# Altium project 004_basit_egitim_robotu.PrjPcb
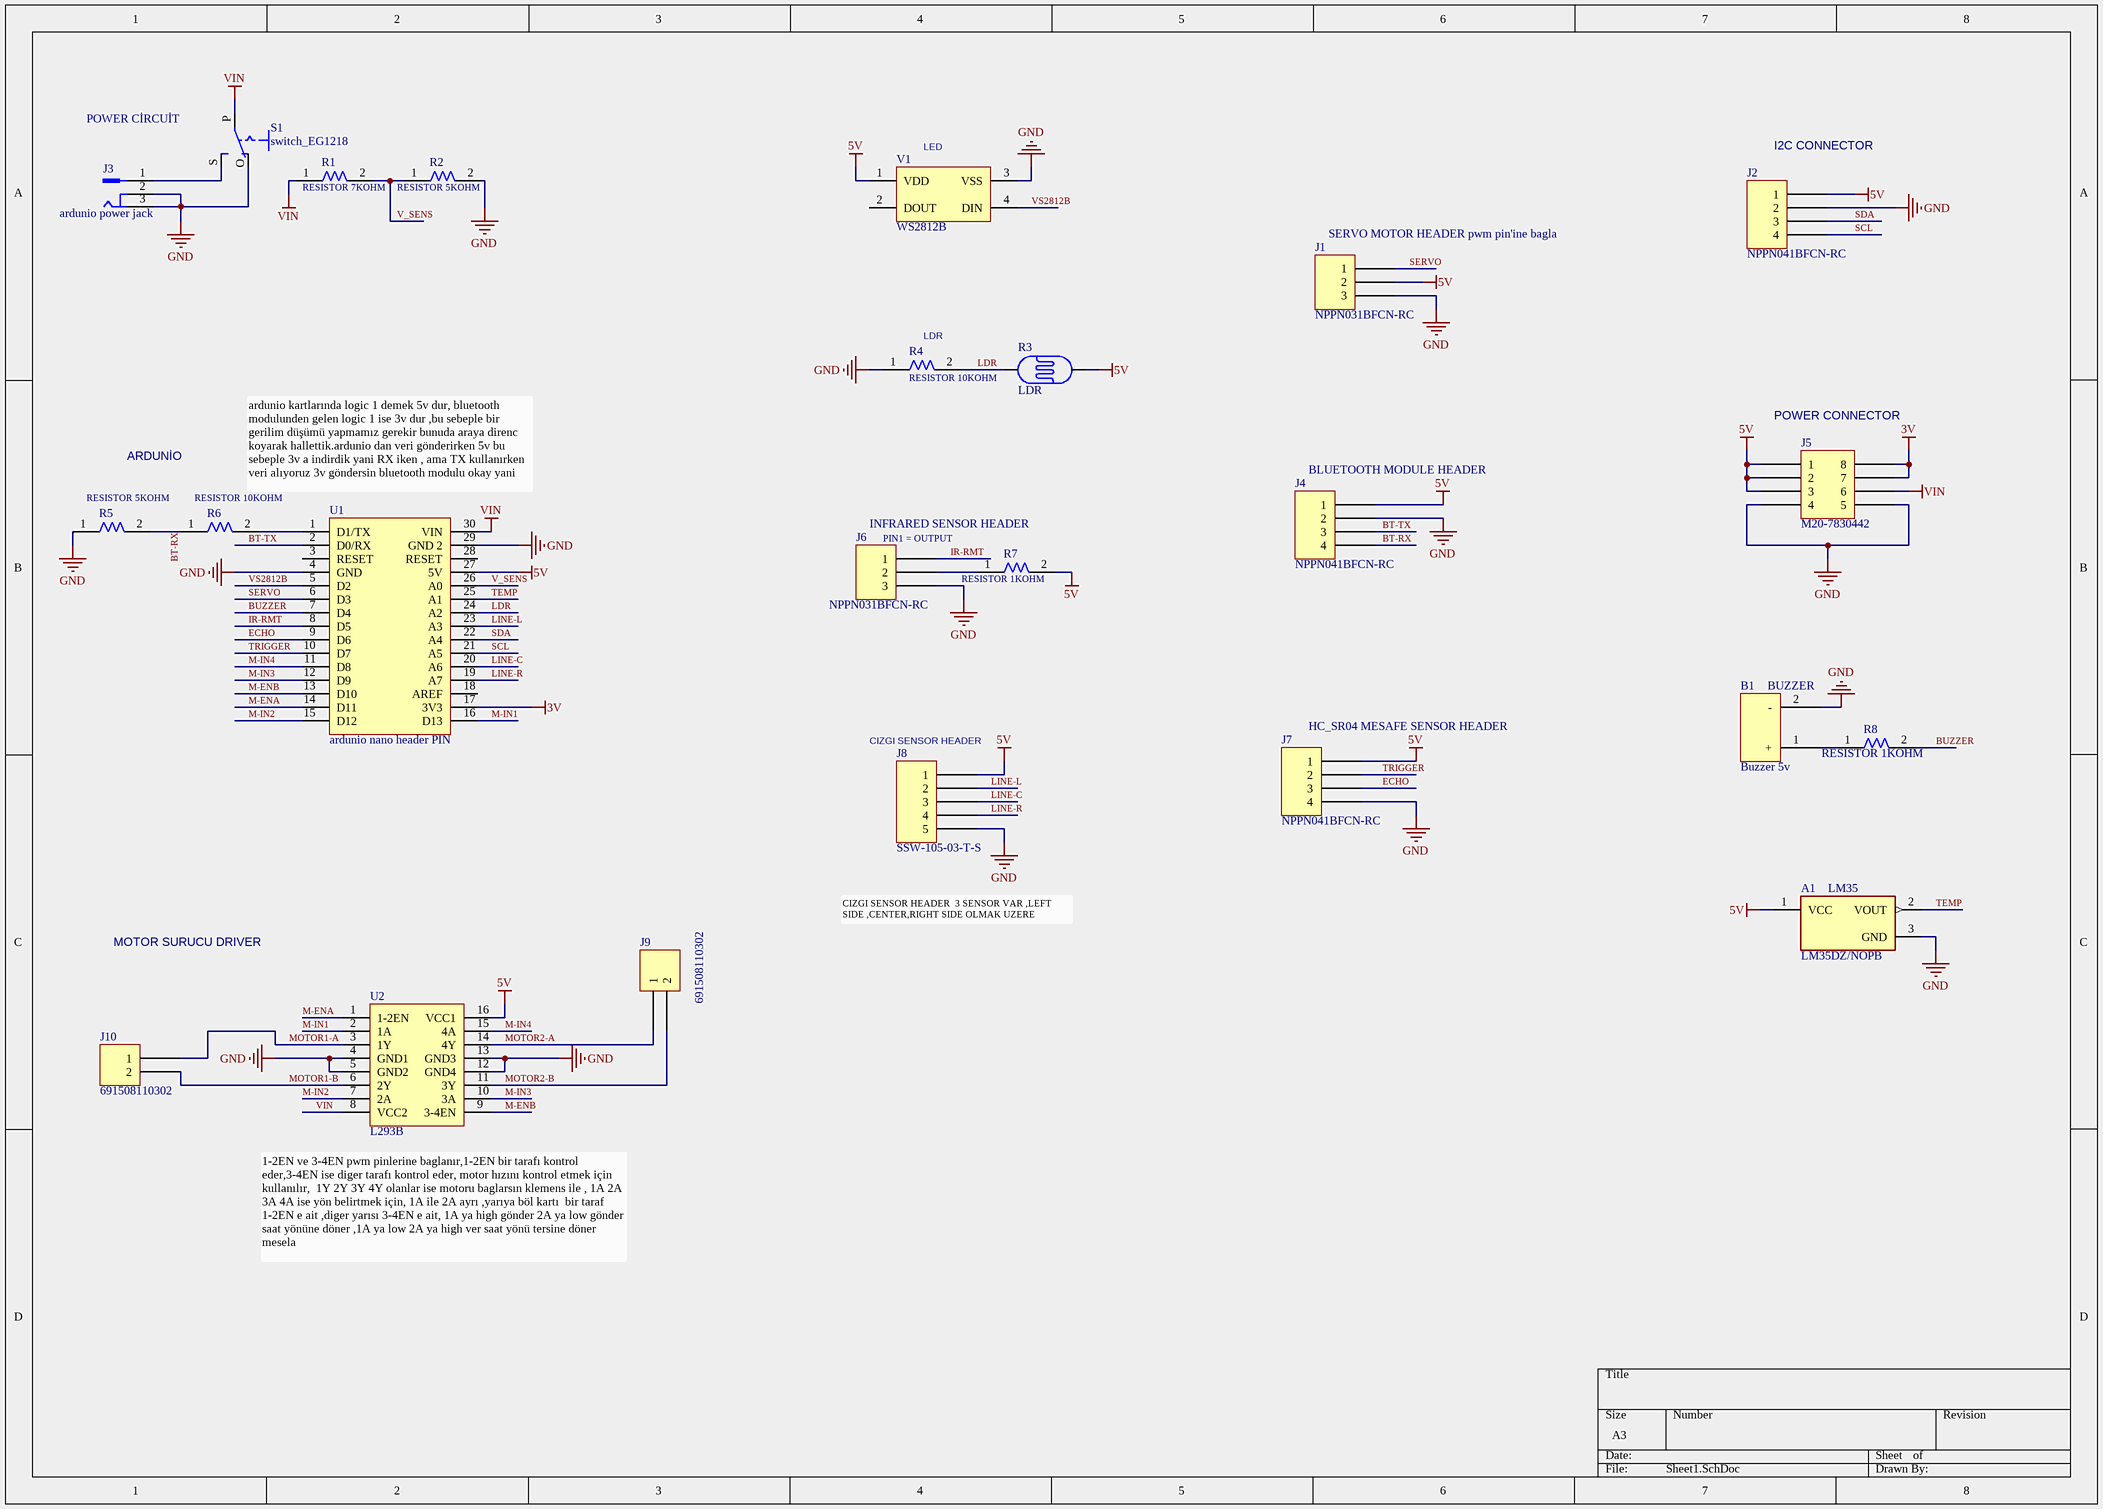
[diagram p0: Sheet1.SchDoc]
1 sheet, 24 parts. Net scope: global (net labels, ports and power ports of the same name join across sheets).
Board file: PCB1.PcbDoc

## Sheet Sheet1.SchDoc
size A3; SheetNumber: 1; SheetTotal: 1

### Parts
A1  LM35DZ/NOPB  [LM35DZ_TO92127P521H735-3]
B1  Buzzer 5v  [Buzzer 5V]
J1  NPPN031BFCN-RC  [SULLINS NPPN031BFCN]
J2  NPPN041BFCN-RC  [SULLINS NPPN041BFCN]
J3  ardunio power jack  [ardunio uno power jack]
J4  NPPN041BFCN-RC  [SULLINS NPPN041BFCN]
J5  M20-7830442  [HARWIN M20-7830445]
J6  NPPN031BFCN-RC  [SULLINS NPPN031BFCN]
J7  NPPN041BFCN-RC  [SULLINS NPPN041BFCN]
J8  SSW-105-03-T-S  [SAMTEC SSW-105-03-T-S]
J9  691508110302  [WURTH 691508110302]
J10  691508110302  [WURTH 691508110302]
R1  RESISTOR 7KOHM  [RES50]
R2  RESISTOR 5KOHM  [RES50]
R3  LDR  [LDR]
R4  RESISTOR 10KOHM  [RES50]
R5  RESISTOR 5KOHM  [RES50]
R6  RESISTOR 10KOHM  [RES50]
R7  RESISTOR 1KOHM  [RES50]
R8  RESISTOR 1KOHM  [RES50]
S1  switch_EG1218  [EG1218]
U1  ardunio nano header PIN  [ARDUNIO NANO]
U2  L293B  [L293B-L293D]
V1  WS2812B  [WS2812B]

### Nets
3V: J5.7 J5.8 U1.17(3V3)
5V: A1.1(VCC) J1.2 J2.1 J4.1 J5.1 J5.2 J5.3 J7.1 J8.1 R3.2(P$2) R7.2 U1.27(5V) U2.16(VCC1) V1.1(VDD)
GND: A1.3(GND) B1.2(-) J1.3 J2.2 J3.2 J3.3 J4.2 J5.4 J5.5 J6.3 J7.4 J8.5 R2.2 R4.1 R5.1 S1.O U1.4(GND) U1.29(GND_2) U2.4(GND1) U2.5(GND2) U2.12(GND4) U2.13(GND3) V1.3(VSS)
VIN: J5.6 R1.1 S1.P U1.30(VIN) U2.8(VCC2)
BT-RX: J4.4 R5.2 R6.1
BT-TX: J4.3 U1.2(D0/RX)
BUZZER: R8.2 U1.7(D4)
ECHO: J7.3 U1.9(D6)
IR-RMT: J6.1 U1.8(D5)
LDR: R3.1(P$1) R4.2 U1.24(A2)
LINE-C: J8.3 U1.20(A6)
LINE-L: J8.2 U1.23(A3)
LINE-R: J8.4 U1.19(A7)
M-ENA: U1.14(D11) U2.1(1-2EN)
M-ENB: U1.13(D10) U2.9(3-4EN)
M-IN1: U1.16(D13) U2.2(1A)
M-IN2: U1.15(D12) U2.7(2A)
M-IN3: U1.12(D9) U2.10(3A)
M-IN4: U1.11(D8) U2.15(4A)
MOTOR1-A: J10.1 U2.3(1Y)
MOTOR1-B: J10.2 U2.6(2Y)
MOTOR2-A: J9.1 U2.14(4Y)
MOTOR2-B: J9.2 U2.11(3Y)
SCL: J2.4 U1.21(A5)
SDA: J2.3 U1.22(A4)
SERVO: J1.1 U1.6(D3)
TEMP: A1.2(VOUT) U1.25(A1)
TRIGGER: J7.2 U1.10(D7)
V_SENS: R1.2 R2.1 U1.26(A0)
VS2812B: U1.5(D2) V1.4(DIN)
NetB1_1: B1.1(+) R8.1
NetJ3_1: J3.1 S1.S
NetJ6_2: J6.2 R7.1
NetR6_2: R6.2 U1.1(D1/TX)

Not connected (* = marked no-connect by the designer): U1 3(RESET) 18(AREF) 28(RESET); V1 2(DOUT)

### Notes on the sheet
- POWER CİRCUİT
- (near V1) LED
- (near J2) I2C CONNECTOR
- (near J1) SERVO MOTOR HEADER pwm pin'ine bagla
- (near R4) LDR
- (near J5) POWER CONNECTOR
- ARDUNİO
- ardunio kartlarında logic 1 demek 5v dur, bluetooth modulunden gelen logic 1 ise 3v dur ,bu sebeple bir gerilim düşümü yapmamız gerekir bunuda araya direnc koyarak hallettik.ardunio dan veri gönderirken 5v bu sebeple 3v a indirdik yani RX iken , ama TX kullanırken veri alıyoruz 3v göndersin bluetooth modulu okay yani
- (near J4) BLUETOOTH MODULE HEADER
- INFRARED SENSOR HEADER
- (near J6) PIN1 = OUTPUT
- (near B1) BUZZER
- (near J8) CIZGI SENSOR HEADER
- (near J7) HC_SR04 MESAFE SENSOR HEADER
- CIZGI SENSOR HEADER  3 SENSOR VAR ,LEFT SIDE ,CENTER,RIGHT SIDE OLMAK UZERE
- (near A1) LM35
- MOTOR SURUCU DRIVER
- (near U2) 1-2EN ve 3-4EN pwm pinlerine baglanır,1-2EN bir tarafı kontrol eder,3-4EN ise diger tarafı kontrol eder, motor hızını kontrol etmek için kullanılır,  1Y 2Y 3Y 4Y olanlar ise motoru baglarsın klemens ile , 1A 2A 3A 4A ise yön belirtmek için, 1A ile 2A ayrı ,yarıya böl kartı  bir taraf 1-2EN e ait ,diger yarısı 3-4EN e ait, 1A ya high gönder 2A ya low gönder  saat yönüne döner ,1A ya low 2A ya high ver saat yönü tersine döner mesela

### Library data of the parts
A1 = LM35DZ/NOPB: LM35DZ TEMPERATURE SENSOR; Package: None; Price: None; Availability: Unavailable; MP: LM35DZ/NOPB; Value: *
J1 J6 = NPPN031BFCN-RC: CONN HDR 3POS 0.079 GOLD PCB; Manufacturer: Sullins Connector Solutions; Connector Type: Header; Contact Length - Post: 0.094" (2.40mm); Current Rating (Amps): 2A; Material Flammability Rating: UL94 V-0; Number of Positions: 3; Number of Positions Loaded: All; Pitch - Mating: 0.079" (2.00mm); Style: Board to Board; Part Number: NPPN031BFCN-RC; ComponentLink1Description: Datasheet; ComponentLink1URL: https://drawings-pdf.s3.amazonaws.com/10483.pdf; ComponentLink2Description: DigiKey Link; ComponentLink2URL: https://www.digikey.com/en/products/detail/sullins-connector-solutions/NPPN031BFCN-RC/804805; Contact Finish - Mating: Gold; Contact Finish - Post: Gold; Contact Finish Thickness - Mating: Flash; Contact Type: Female Socket; Fastening Type: Push-Pull; Insulation Color: Black; Insulation Height: 0.173" (4.40mm); LastUpdated: 6/21/2022 2:42:20 PM; Lifecycle Status: Active; Minimum Order: 1; Mounting Type: Through Hole; Number of Rows: 1; Operating Temperature: -40°C ~ 105°C; Packaging: Tube; Part Status: Active; Price: 0.25; Series: -; Supplier 1: DigiKey; Supplier Part Number 1: S5751-03-ND; Termination: Solder
J2 J4 J7 = NPPN041BFCN-RC: CONN HDR 4POS 0.079 GOLD PCB; Manufacturer: Sullins Connector Solutions; Connector Type: Header; Contact Length - Post: 0.094" (2.40mm); Current Rating (Amps): 2A; Material Flammability Rating: UL94 V-0; Number of Positions: 4; Number of Positions Loaded: All; Pitch - Mating: 0.079" (2.00mm); Style: Board to Board; Part Number: NPPN041BFCN-RC; ComponentLink1Description: Datasheet; ComponentLink1URL: https://drawings-pdf.s3.amazonaws.com/10483.pdf; ComponentLink2Description: DigiKey Link; ComponentLink2URL: https://www.digikey.com/en/products/detail/sullins-connector-solutions/NPPN041BFCN-RC/804806; Contact Finish - Mating: Gold; Contact Finish - Post: Gold; Contact Finish Thickness - Mating: Flash; Contact Type: Female Socket; Fastening Type: Push-Pull; Insulation Color: Black; Insulation Height: 0.173" (4.40mm); LastUpdated: 6/21/2022 2:42:51 PM; Lifecycle Status: Active; Minimum Order: 1; Mounting Type: Through Hole; Number of Rows: 1; Operating Temperature: -40°C ~ 105°C; Packaging: Tube; Part Status: Active; Price: 0.30; Series: -; Supplier 1: DigiKey; Supplier Part Number 1: S5751-04-ND; Termination: Solder
J3 = ardunio power jack: CONN PWR JACK 2X5.5MM SOLDER  ,PJ-102AH
J5 = M20-7830442: CONN RCPT 8POS 0.1 GOLD PCB; Manufacturer: Harwin Inc.; Connector Type: Receptacle; Contact Length - Post: 0.118" (3.00mm); Current Rating (Amps): 3A; Mated Stacking Heights: 11.04mm, 12.63mm; Material Flammability Rating: UL94 V-0; Number of Positions: 8; Number of Positions Loaded: All; Pitch - Mating: 0.100" (2.54mm); Style: Board to Board or Cable; Part Number: M20-7830442; ComponentLink1Description: Datasheet; ComponentLink1URL: https://cdn.harwin.com/pdfs/C001XX_M20_Series_Connectors.pdf; ComponentLink2Description: DigiKey Link; ComponentLink2URL: http://digikey.com/product-detail/en/harwin-inc/M20-7830442/952-1789-ND/3727758; Contact Finish - Mating: Gold; Contact Finish - Post: Tin; Contact Finish Thickness - Mating: Flash; Contact Type: Female Socket; Fastening Type: Push-Pull; Insulation Color: Black; Insulation Height: 0.335" (8.51mm); LastUpdated: 9/21/2022 7:04:26 PM; Lifecycle Status: Active; Minimum Order: 1; Mounting Type: Through Hole; Number of Rows: 2; Operating Temperature: -40°C ~ 105°C; Packaging: Tube; Part Status: Active; Price: 1.36; Row Spacing - Mating: 0.100" (2.54mm); Series: M20; Supplier 1: DigiKey; Supplier Part Number 1: 952-1789-ND; Termination: Solder
J8 = SSW-105-03-T-S: CONN RCPT 5POS 0.1 TIN PCB; Manufacturer: Samtec Inc.; Connector Type: Receptacle; Current Rating (Amps): 5.7A per Contact; Material Flammability Rating: UL94 V-0; Number of Positions: 5; Number of Positions Loaded: All; Style: Board to Board or Cable; Part Number: SSW-105-03-T-S; ComponentLink2Description: DigiKey Link; ComponentLink2URL: http://digikey.com/product-detail/en/samtec-inc/SSW-105-03-T-S/SSW-105-03-T-S-ND/7874640; Contact Finish - Mating: Tin; Contact Finish - Post: Tin; Contact Type: Forked; Fastening Type: Push-Pull; Insulation Color: Black; LastUpdated: 6/21/2022 3:09:09 PM; Lifecycle Status: Active; Minimum Order: 1; Mounting Type: Through Hole; Number of Rows: 1; Operating Temperature: -55°C ~ 105°C; Packaging: Bulk; Part Status: Active; Price: 0.85; Series: SSW; Supplier 1: DigiKey; Supplier Part Number 1: SSW-105-03-T-S-ND; Termination: Solder
J9 J10 = 691508110302: TERM BLOCK 2POS 3.5MM SMD; Manufacturer: Würth Elektronik; Current: 10A; Mating Orientation: Horizontal and Vertical with Board; Number of Levels: 1; Pitch: 0.138" (3.50mm); Positions Per Level: 2; Voltage: 300V; Wire Gauge: 16-30 AWG; Wire Termination: Screw - Rising Cage Clamp; Part Number: 691508110302; Color: Black; ComponentLink1Description: Datasheet; ComponentLink1URL: https://katalog.we-online.de/em/datasheet/6915081103xx.pdf; ComponentLink2Description: DigiKey Link; ComponentLink2URL: http://digikey.com/product-detail/en/w-rth-elektronik/691508110302/732-5963-1-ND/5047612; Features: Board Guide, Mounting Flange; LastUpdated: 1/15/2020 4:18:55 AM; Lifecycle Status: Active; Minimum Order: 1; Mounting Type: Surface Mount; Packaging: TapeAndReel; Part Status: Active; Price: 1.57; Series: WR-TBL Series 5081; Supplier 1: DigiKey; Supplier Part Number 1: 732-5963-1-ND
R3 = LDR: MF: Fairway Electronics; Value: *; Check_prices: https://www.snapeda.com/parts/LDR/Applied+Avionics/view-part/?ref=eda; Price: None; Package: None; SnapEDA_Link: https://www.snapeda.com/parts/LDR/Applied+Avionics/view-part/?ref=snap; Availability: In Stock; MP: LDR
R7 R8 = RESISTOR 5KOHM
S1 = switch_EG1218: <b>SLIDING SWITCH</b><p> 0.1" spacing through hole, vertical SPDT slide switch <p>http://www.ladyada.net/library/pcb/eaglelibrary.html</p>; Package: None; Availability: Unavailable; Value: *; MP: EG1218; Price: None
U1 = ardunio nanoheader: ardunio nanoheader pin 2x15
U2 = L293B: L293D ve L293B motor sürücü entegreleri içlerinde iki adet H köprüsü barındıran 16 bacaklı motor sürücü entegrelerdir. Genellikle DC motor kontrolünde tercih edilen motor sürücü entegreler olan L293D ve L293B ile iki motor birbirinden bağımsız olarak çift yönlü kontrol edilebilmektedir.
V1 = WS2812B: BIR CESIT LED , BUNUN ILE TREN YAPARSIN DIN 'I ARDUNIO YA BAGLA ,DOUT 'UDA BASKA WS2812B 'NIN DIN'INA BAGLA BOYLE TREN OLUR SERIT LED GIBI